# EasyEDA Pro project HNDX.eprj, schematic stm32核心板_1
Board Name: stm32g474_1; Create Date: 2025-06-23; Page Name: P1; Project Name: GP; Schematic Name: stm32核心板_1; Update Date: 2025-06-23; Company: 嘉立创EDA; Page Size: A4; Version: V1.0
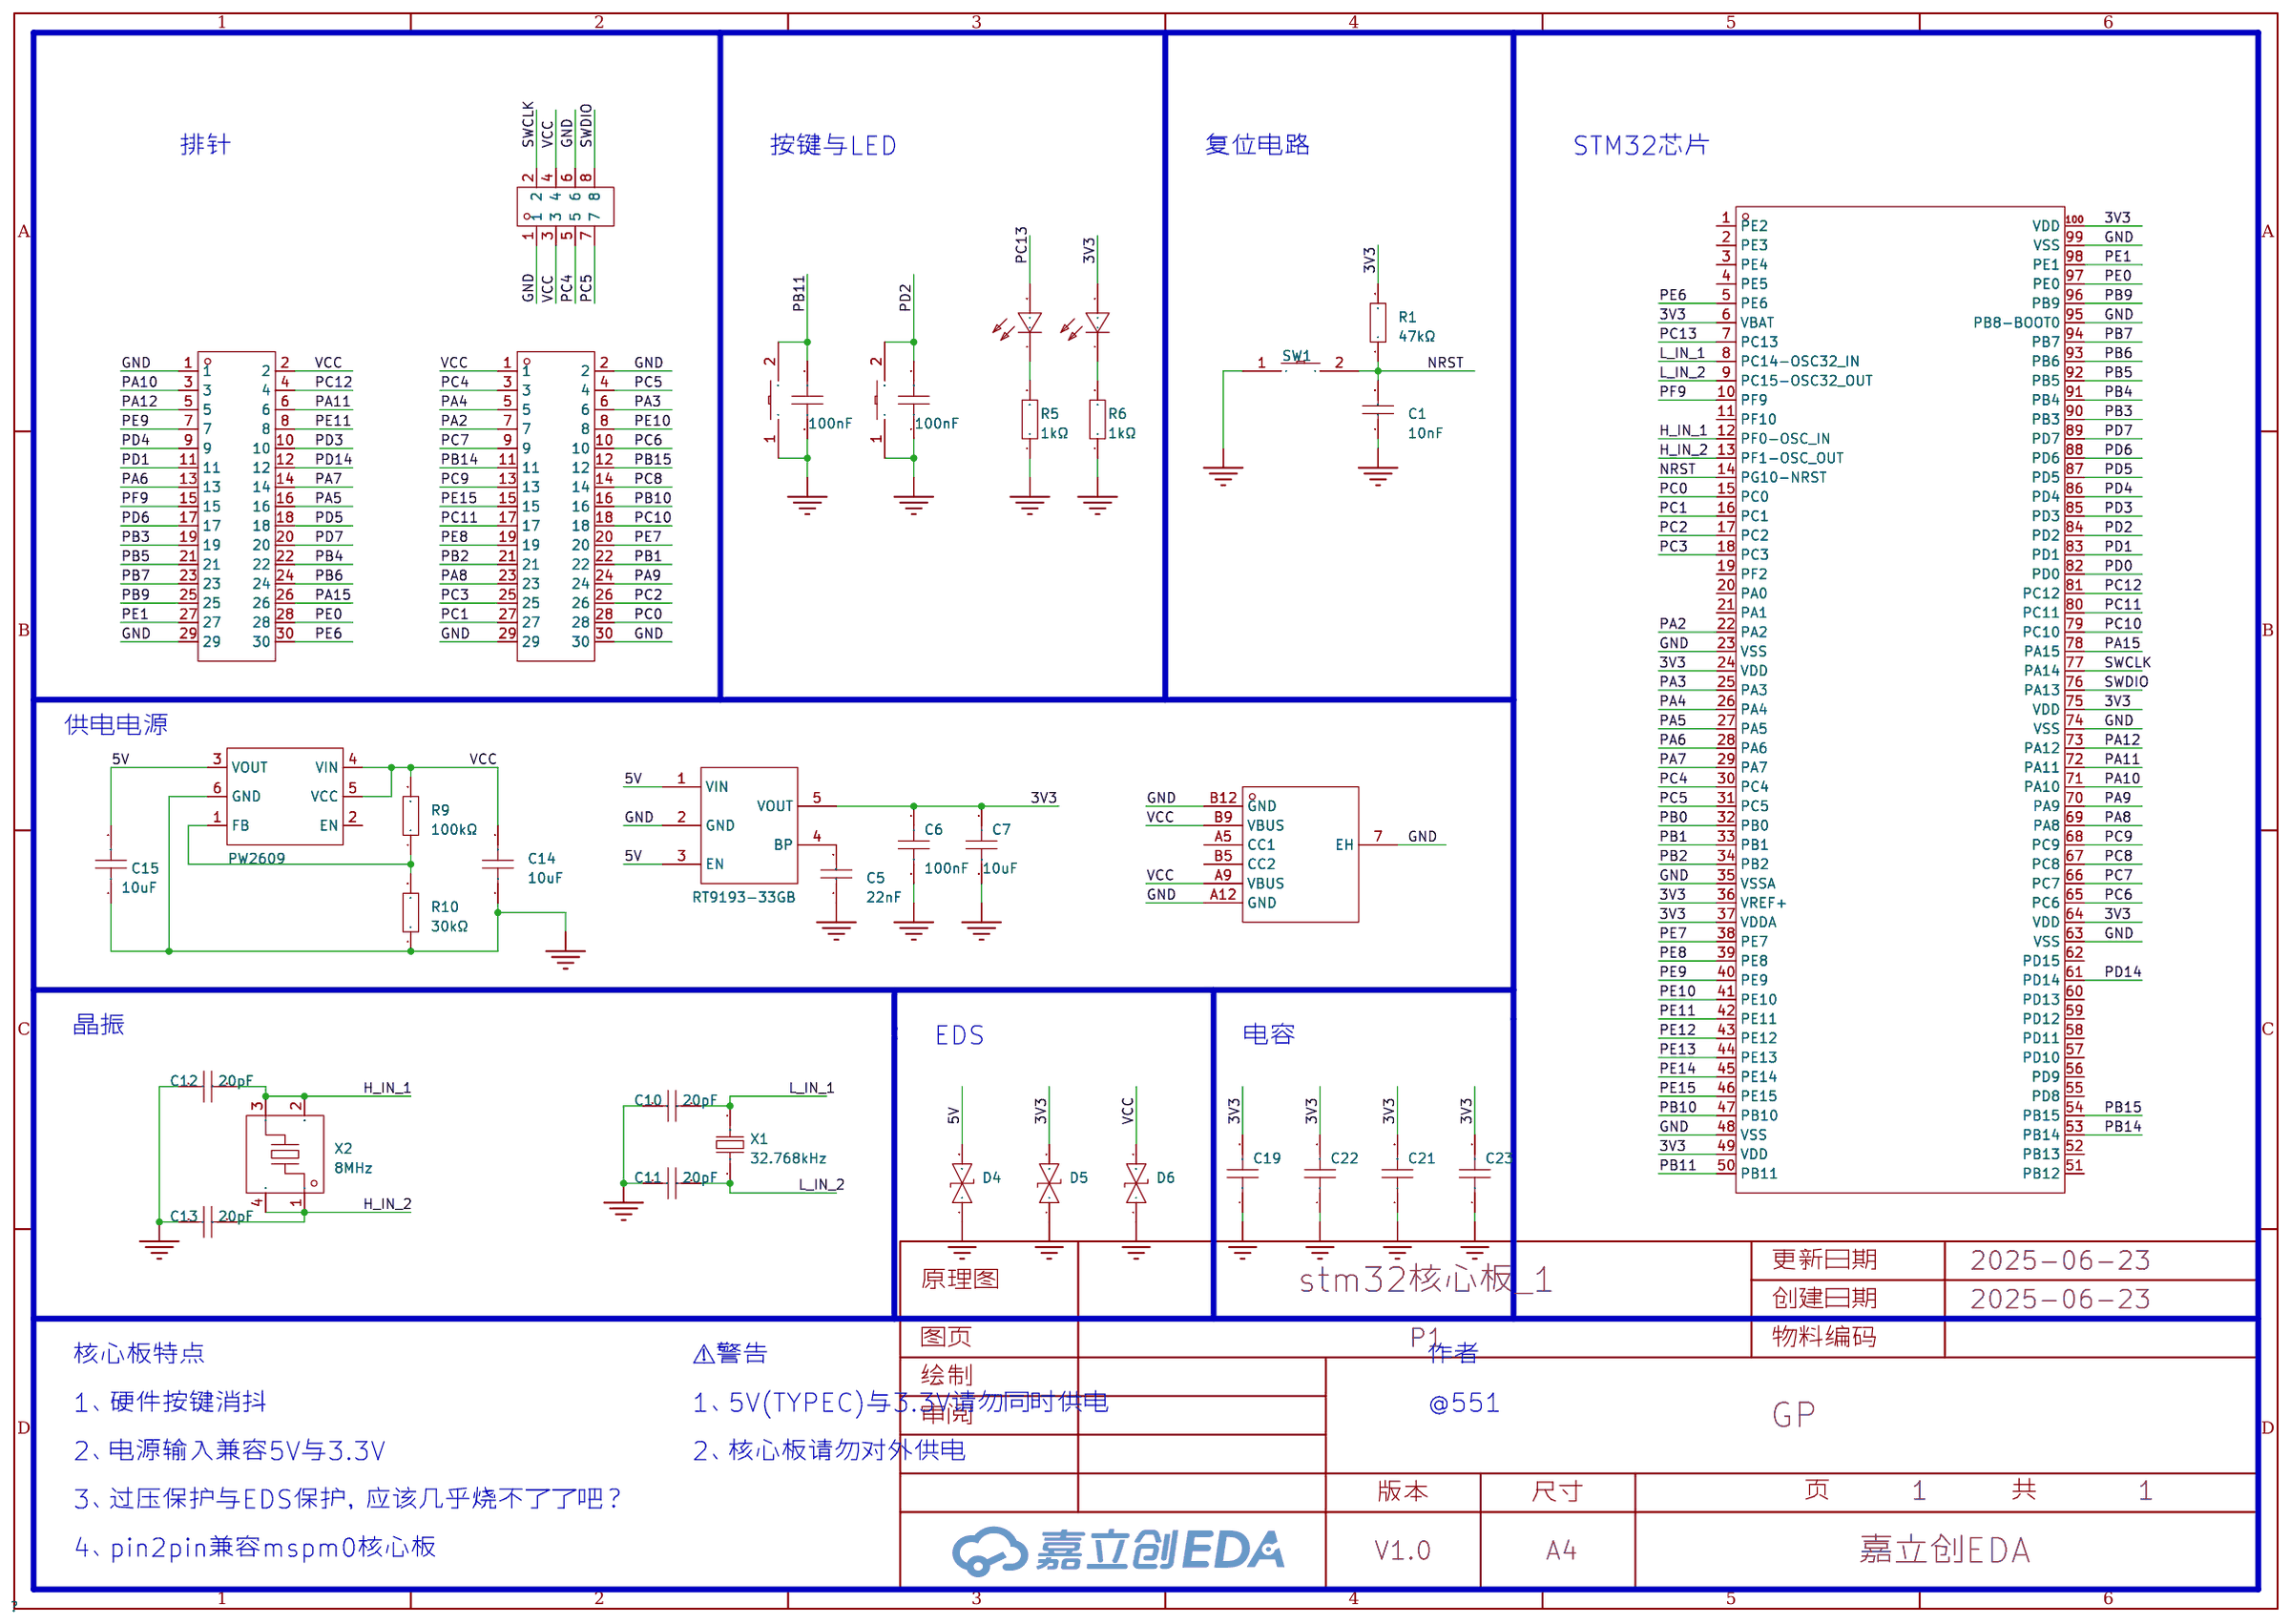
[diagram p6: schematic sheet]

## Parts
C1  10nF  [C0603]
C5  22nF  [C0603]
C6  100nF  [C0603]
C7  10uF  [C0603]
C8  100nF  [C0603]
C9  100nF  [C0603]
C10  20pF  [C0603]
C11  20pF  [C0603]
C12  20pF  [C0603]
C13  20pF  [C0603]
C14  10uF  [C0603]
C15  10uF  [C0603]
C19  100nF  [C0603]
C21  100nF  [C0603]
C22  100nF  [C0603]
C23  100nF  [C0603]
D4  0603ESDA-05N  [D0603-BI]
D5  0603ESDA-05N  [D0603-BI]
D6  0603ESDA-05N  [D0603-BI]
H3  PZ254R-12-8P  [HDR-TH_8P-P2.54-H-M-R2-C4-S2.54]
LED1  NCD0603R1  [LED0603-RD_RED]
LED2  NCD0603R1  [LED0603-RD_RED]
R1  47kΩ  [R0603]
R5  1kΩ  [R0603]
R6  1kΩ  [R0603]
R9  100kΩ  [R0603]
R10  30kΩ  [R0603]
SW1  TS-1101-C-W  [SW-SMD_L6.0-W3.3-LS8.0]
SW2  TS-1101-C-W  [SW-SMD_L6.0-W3.3-LS8.0]
SW3  TS-1101-C-W  [SW-SMD_L6.0-W3.3-LS8.0]
TYPEC  TYPE-C 6P QT073  [USB-C-SMD_TYPE-C-6P-QT073]
U2  RT9193-33GB  [SOT-23-5_L3.0-W1.7-P0.95-LS2.8-BL]
U11  PW2609  [SOT-23-6_L2.9-W1.6-P0.95-LS2.8-BL]
U12  PZ254-2-15-Z-8.5  [HDR-TH_30P-P2.54-V-M-R2-C15-S2.54]
U13  PZ254-2-15-Z-8.5  [HDR-TH_30P-P2.54-V-M-R2-C15-S2.54]
U17  STM32G474VCT6  [LQFP-100_L14.0-W14.0-P0.50-LS16.0-BL]
X1  32.768kHz  [FC-135R_L3.2-W1.5]
X2  8MHz  [CRYSTAL-SMD_4P-L3.2-W2.5-BL-1]

## Library data of the parts
C1 = CC0603KRX7R9BB103: 容值:10nF;精度:±10%;额定电压:50V;材质(温度系数):X7R;; LCSC Part Name: 10nF ±10% 50V; Supplier Part: C100042; Manufacturer: YAGEO(国巨); Supplier Footprint: 0603; JLCPCB Part Class: 扩展库; Datasheet: https://atta.szlcsc.com/upload/public/pdf/source/20181008/C309510_22F155564471FAF6A489F7D68F34234E.pdf; Supplier: LCSC; Tolerance: ±10%; Voltage Rated: 50V; Temperature Coefficient: X7R
C5 = CL10B223KB8NNNC: 容值:22nF;精度:±10%;额定电压:50V;材质(温度系数):X7R;; LCSC Part Name: 22nF ±10% 50V; Supplier Part: C21122; Manufacturer: SAMSUNG(三星); Supplier Footprint: 0603; JLCPCB Part Class: 基础库; Datasheet: https://atta.szlcsc.com/upload/public/pdf/source/20160218/1457707763339.pdf; Supplier: LCSC; Tolerance: ±10%; Voltage Rated: 50V; Temperature Coefficient: X7R
C6 C8 C9 C19 C21-C23 = CC0603KRX7R9BB104: 容值:100nF;精度:±10%;额定电压:50V;材质(温度系数):X7R;; LCSC Part Name: 100nF ±10% 50V; Supplier Part: C14663; Manufacturer: YAGEO(国巨); Supplier Footprint: 0603; JLCPCB Part Class: 基础库; Datasheet: https://atta.szlcsc.com/upload/public/pdf/source/20180910/C282072_33301C7F631E79921B82A8DAC6BCC5B3.pdf; Supplier: LCSC; Tolerance: ±10%; Voltage Rated: 50V; Temperature Coefficient: X7R
C7 = GRM188R61E106KA73D: 容值:10uF;精度:±10%;额定电压:25V;材质(温度系数):X5R;; LCSC Part Name: 10uF ±10% 25V; Supplier Part: C344022; Manufacturer: muRata(村田); Supplier Footprint: 0603; JLCPCB Part Class: 扩展库; Datasheet: https://atta.szlcsc.com/upload/public/pdf/source/20181211/C344022_BB98D43E7DA95E5A749FBFE073C8A3E0.pdf; Supplier: LCSC; Tolerance: ±10%; Voltage Rated: 25V; Temperature Coefficient: X5R
C10-C13 = CC0603JRNPO9BN200: 容值:20pF;精度:±5%;额定电压:50V;材质(温度系数):NP0;; LCSC Part Name: 20pF ±5% 50V; Supplier Part: C105621; Manufacturer: YAGEO(国巨); Supplier Footprint: 0603; JLCPCB Part Class: 扩展库; Datasheet: https://atta.szlcsc.com/upload/public/pdf/source/20170505/1493957838062.pdf; Supplier: LCSC; Tolerance: ±5%; Voltage Rated: 50V; Temperature Coefficient: NP0
C14 C15 = CL10A106KP8NNNC: 容值:10uF;精度:±10%;额定电压:10V;材质(温度系数):X5R;; LCSC Part Name: 10uF ±10% 10V; Supplier Part: C19702; Manufacturer: SAMSUNG(三星); Supplier Footprint: 0603; JLCPCB Part Class: 基础库; Datasheet: https://atta.szlcsc.com/upload/public/pdf/source/20160218/1457707763339.pdf; Supplier: LCSC; Tolerance: ±10%; Voltage Rated: 10V; Temperature Coefficient: X5R
D4-D6 = 0603ESDA-05N: LCSC Part Name: 双向ESD; Supplier Part: C316054; Manufacturer: BORN(伯恩半导体); Supplier Footprint: 0603; JLCPCB Part Class: 扩展库; Datasheet: https://atta.szlcsc.com/upload/public/pdf/source/20200528/C316054_1CC523E9CE69E41C8DD5A05C832CCD1A.pdf; Supplier: LCSC; polarity: 双向; Reverse Stand-Off Voltage (Vrwm): 5V; Maximum Clamping Voltage: 50V; Type: ESD
H3 = PZ254R-12-8P: 插针结构:2x4P;间距:2.54mm;行距:2.54mm;圆针/方针:方针;安装类型:弯插;排数:双排;总PIN位数:8P;额定电流:-;额定电压:-;配合针长度:6mm;塑高:2.5mm;触头材质:黄铜;触头镀层:-;工作温度范围:-40℃~+105℃;颜色:黑色;; LCSC Part Name: 间距:2.54mm 2x4P 弯插 方针; Supplier Part: C492432; Manufacturer: XFCN(兴飞); Supplier Footprint: 弯插,P=2.54mm; JLCPCB Part Class: 扩展库; Datasheet: https://atta.szlcsc.com/upload/public/pdf/source/20200309/C492432_F55471C7391A7FE3415CB31C718B6320.pdf; Supplier: LCSC; Pin Structure: 2x4P; Pitch: 2.54mm; Row Spacing: 2.54mm; Circluar Pins/Square Pins: 方针; Mounting Type: 弯插; Number of Rows: 双排; Number of Pins: 8P; Length of Mating Pin: 6mm; Insulation Height: 2.5mm; Contact Material: 黄铜; Operating Temperature Range: -40℃~+105℃; Color: 黑色
LED1 LED2 = NCD0603R1_C84263: 灯头类型:-;发光颜色:红色;正向电压(VF):1.6V~2.6V;功率:65mW;正向电流:20mA;主波长:615nm~630nm;二极管配置:独立二极管;透镜颜色:无色透明透镜;色温:-;发光强度:80mcd~220mcd;发光角度:130°;载带方式:-;工作温度:-30℃~+85℃;; Supplier Part: C84263; Manufacturer: 国星光电; Supplier Footprint: 0603; JLCPCB Part Class: 扩展库; Datasheet: https://atta.szlcsc.com/upload/public/pdf/source/20200820/C84263_DABC6A75E58F576973B407FDBA283D60.pdf; Supplier: LCSC; Emitted Color: 红色; Forward Voltage (VF): 1.6V~2.6V; Power Dissipation: 65mW; Forward Current: 20mA; Dominant Wavelength: 615nm~630nm; Diode Configuration: 独立二极管; Lens Color: 无色透明透镜; Luminous Intensity: 80mcd~220mcd; Viewing Angle: 130°; Operating Temperature: -30℃~+85℃
R1 = 0603WAF4702T5E: 电阻类型:厚膜电阻;阻值:47kΩ;精度:±1%;功率:100mW;最大工作电压:75V;温度系数:±100ppm/℃;; LCSC Part Name: 47kΩ ±1% 100mW 厚膜电阻; Supplier Part: C25819; Manufacturer: UNI-ROYAL(厚声); Supplier Footprint: 0603; JLCPCB Part Class: 基础库; Datasheet: https://atta.szlcsc.com/upload/public/pdf/source/20200306/C422600_1E6D84923E4A46A82E41ADD87F860B5C.pdf; Supplier: LCSC; Type: 厚膜电阻; Tolerance: ±1%; Power(Watts): 100mW; Overload Voltage (Max): 75V; Temperature Coefficient: ±100ppm/℃; Operating Temperature Range: -55℃~+155℃
R5 R6 = 0603WAF1001T5E: 电阻类型:厚膜电阻;阻值:1kΩ;精度:±1%;功率:100mW;最大工作电压:75V;温度系数:±100ppm/℃;; LCSC Part Name: 1kΩ ±1% 100mW 厚膜电阻; Supplier Part: C21190; Manufacturer: UNI-ROYAL(厚声); Supplier Footprint: 0603; JLCPCB Part Class: 基础库; Datasheet: https://atta.szlcsc.com/upload/public/pdf/source/20200306/C422600_1E6D84923E4A46A82E41ADD87F860B5C.pdf; Supplier: LCSC; Type: 厚膜电阻; Tolerance: ±1%; Power(Watts): 100mW; Overload Voltage (Max): 75V; Temperature Coefficient: ±100ppm/℃; Operating Temperature Range: -55℃~+155℃
R9 = RC0603FR-07100KL: 电阻类型:厚膜电阻;阻值:100kΩ;精度:±1%;功率:100mW;最大工作电压:75V;温度系数:±100ppm/℃;; LCSC Part Name: 厚膜电阻 100kΩ ±1% 100mW; Supplier Part: C14675; Manufacturer: YAGEO(国巨); Supplier Footprint: 0603; JLCPCB Part Class: 扩展库; Datasheet: https://atta.szlcsc.com/upload/public/pdf/source/20140324/1457707028752.pdf; Supplier: LCSC; Type: 厚膜电阻; Tolerance: ±1%; Power(Watts): 100mW; Overload Voltage (Max): 75V; Temperature Coefficient: ±100ppm/℃; Operating Temperature Range: -55℃~+155℃
R10 = 0603WAF3002T5E: 电阻类型:厚膜电阻;阻值:30kΩ;精度:±1%;功率:100mW;最大工作电压:75V;温度系数:±100ppm/℃;; LCSC Part Name: 30kΩ ±1% 100mW 厚膜电阻; Supplier Part: C22984; Manufacturer: UNI-ROYAL(厚声); Supplier Footprint: 0603; JLCPCB Part Class: 基础库; Datasheet: https://atta.szlcsc.com/upload/public/pdf/source/20200306/C422600_1E6D84923E4A46A82E41ADD87F860B5C.pdf; Supplier: LCSC; Type: 厚膜电阻; Tolerance: ±1%; Power(Watts): 100mW; Overload Voltage (Max): 75V; Temperature Coefficient: ±100ppm/℃; Operating Temperature Range: -55℃~+155℃
SW1-SW3 = TS-1101-C-W: 电路结构:单刀单掷;按钮形状:矩形按钮;作用力:260gf;安装方式:立贴;开关长度:6mm;开关宽度:3.6mm;开关高度:2.5mm;带支架:不带;触点电流:50mA;额定电压(AC):-;额定电压(DC):12V;额定功率:-;绝缘电阻:-;带灯:无;机械寿命:5万次;; LCSC Part Name: 6*3.6*2.5mm 立贴 轻触开关; Supplier Part: C318938; Manufacturer: XKB Connectivity(中国星坤); Supplier Footprint: SMD; JLCPCB Part Class: 扩展库; Datasheet: https://atta.szlcsc.com/upload/public/pdf/source/20200227/C318938_C2E53B1EEDE37D980A33616AC086DE53.pdf; Supplier: LCSC; Circuit: 单刀单掷; Actuator Style: 矩形按钮; Operating Force: 260gf; Mounting Style: 立贴; Switch Length: 6mm; Switch Width: 3.6mm; Switch Height: 2.5mm; Strike Gundam: 不带; Contact Current: 50mA; Voltage Rating (DC): 12V; Actuator/Cap Color: 白色带淡绿; With Lamp: 无; Mechanical Life: 5万次; Operating Temperature: -30℃~+85℃
TYPEC = TYPE-C 6P QT073: LCSC Part Name: Type-C 母 卧贴; Supplier Part: C2681548; Manufacturer: SHOU HAN(首韩); Supplier Footprint: SMD; JLCPCB Part Class: 扩展库; Datasheet: https://atta.szlcsc.com/upload/public/pdf/source/20220215/CBBB29EB4E3B4CE4A38B8E19076C4334.pdf; Supplier: LCSC; Connector Type: Type-C; Standard: USB 3.1; Gender: 母; Mounting Style: 卧贴; Number of Contacts: 6P; Number of Ports: 1; Current Rating - Power (Max): 3A; Operating Temperature Range: -25℃~+85℃; Rated Voltage (Max): 5V; Connect-Disconnect Life: 1万次; Core Colour: 黑色
U2 = RT9193-33GB: 输出类型:固定;最大输入电压:5.5V;输出电压:3.3V;最大输出电流:300mA;电源纹波抑制比(PSRR):70dB;输出极性:正极;; LCSC Part Name: 输入5.5V 输出3.3V 300mA; Supplier Part: C15651; Manufacturer: RICHTEK(立锜); Supplier Footprint: SOT-23-5; JLCPCB Part Class: 扩展库; Datasheet: https://atta.szlcsc.com/upload/public/pdf/source/20130730/1457706628575.pdf; Supplier: LCSC; Output Type: 固定; Maximum Input Voltage: 5.5V; Output Voltage: 3.3V; MAX Output Current: 300mA; Power Supply Rejection Ratio (PSRR): 70dB; Dropout Voltage: 300mV@(300mA); standby current: 130uA; Operating Temperature: -40℃~+125℃; Output Polarity: 正极; Number of Outputs: 1
U11 = PW2609: Supplier Part: C9900022406; Supplier Footprint: SOT-23-6; JLCPCB Part Class: 扩展库; Supplier: LCSC
U12 U13 = PZ254-2-15-Z-8.5: 插针结构:2x15P;间距:2.54mm;圆针/方针:方针;安装类型:直插;排数:双排;总PIN位数:30P;额定电流:3A;额定电压:-;配合针长度:6mm;塑高:2.5mm;端接针长度:3mm;触头材质:黄铜;工作温度范围:-40℃~+105℃;焊接温度(最大值):260℃@10S;颜色:黑色;; LCSC Part Name: 2x15P 间距:2.54mm 方针 直插; Supplier Part: C3012255; Manufacturer: HCTL(华灿天禄); Supplier Footprint: 插件,P=2.54mm; JLCPCB Part Class: 扩展库; Datasheet: https://atta.szlcsc.com/upload/public/pdf/source/20230609/5BA09C8BEB9B31376F8BF6032FF67CAC.pdf; Supplier: LCSC; Pin Structure: 2x15P; Pitch: 2.54mm; Circluar Pins/Square Pins: 方针; Mounting Type: 直插; Number of Rows: 双排; Number of Pins: 30P; Current Rating (Max): 3A; Length of Mating Pin: 6mm; Insulation Height: 2.5mm; Length of End Connection Pin: 3mm; Contact Material: 黄铜; Operating Temperature Range: -40℃~+105℃; Soldering Temperature(Max): 260℃@10S; Color: 黑色
U17 = STM32G474VCT6: CPU内核:-;程序存储容量:256KB;RAM总容量:128KB;GPIO端口数量:86;工作电压范围:1.71V~3.6V;CPU最大主频:170MHz;程序存储器类型:FLASH;; LCSC Part Name: 带DSP和FPU的170MHz主流ARM Cortex-M4 MCU，具有256 KB Flash存储器、数学加速器、高分辨率定时器和高模拟电平集成; Supplier Part: C730131; Manufacturer: ST(意法半导体); Supplier Footprint: LQFP-100(14x14); JLCPCB Part Class: 扩展库; Datasheet: https://atta.szlcsc.com/upload/public/pdf/source/20200902/C431632_38212262685EE30B1989689374F08940.pdf; Supplier: LCSC; Program Storage Size: 256KB; RAM Size: 128KB; GPIO Ports Number: 86; Operating Voltage Range: 1.71V~3.6V; CPU Maximum Speed: 170MHz; Program Memory Type: FLASH; Operating Temperature Range: -40℃~+85℃; ADC (Bit): 12bit; DAC (Bit): 12bit; Peripheral/Function: PWM；PWM; Watchdog: 有; Infrared Data Association: 有; Low-Voltage Detect: 有; Direct Memory Access: 有; Internal Oscillator: 有
X1 = Q13FC13500004_C32346: 晶振类型:贴片晶振;频率:32.768kHz;常温频差:±20ppm;外接负载电容:12.5pF;; LCSC Part Name: 32.768kHz ±20ppm 12.5pF; Supplier Part: C32346; Manufacturer: EPSON(爱普生); Manufacturer Part: Q13FC13500004; Supplier Footprint: SMD3215-2P; JLCPCB Part Class: 基础库; Datasheet: https://atta.szlcsc.com/upload/public/pdf/source/20240418/0E0FF5F0356BA3753F616001439D1416.pdf; Supplier: LCSC; Crystal Type: 贴片晶振; Normal temperature Frequency Tolerance: ±20ppm; External load capacitor: 12.5pF; Equivalent Series Resistance (ESR): 70kΩ; Operating Temperature: -40℃~+85℃
X2 = XL2EL89COI-111YLC-8M: 晶振类型:贴片晶振;频率:8MHz;常温频差:±10ppm;外接负载电容:12pF;频率稳定度(全温):±20ppm;; LCSC Part Name: 8MHz ±10ppm 12pF; Supplier Part: C2973805; Manufacturer: YXC(扬兴晶振); Supplier Footprint: SMD3225-4P; JLCPCB Part Class: 扩展库; Datasheet: https://atta.szlcsc.com/upload/public/pdf/source/20240329/19D5F850207469550BEB00D7DFEDBC7A.pdf; Supplier: LCSC; Crystal Type: 贴片晶振; Normal temperature Frequency Tolerance: ±10ppm; External load capacitor: 12pF; Frequency Stability(Full temperature range): ±20ppm; Equivalent Series Resistance (ESR): 150Ω; Operating Temperature: -40℃~+85℃

## Nets
3V3: C6.1 C7.1 C19.2 C21.2 C22.2 C23.2 D5.2 LED2.2(A) R1.2 U2.5(VOUT) U17.6(VBAT) U17.24(VDD) U17.36(VREF+) U17.37(VDDA) U17.49(VDD) U17.64(VDD) U17.75(VDD) U17.100(VDD)
5V: C15.2 D4.2 U2.1(VIN) U2.3(EN) U11.3(VOUT)
GND: C1.1 C5.1 C6.2 C7.2 C8.2 C9.1 C10.1 C11.1 C12.1 C13.1 C14.1 C15.1 C19.1 C21.1 C22.1 C23.1 D4.1 D5.1 D6.1 H3.1 H3.6 R5.1 R6.1 R10.1 SW1.1 SW2.1 SW3.1 TYPEC.7(EH) TYPEC.A12(GND) TYPEC.B12(GND) U2.2(GND) U11.6(GND) U12.2 U12.29 U12.30 U13.1 U13.29 U17.23(VSS) U17.35(VSSA) U17.48(VSS) U17.63(VSS) U17.74(VSS) U17.95(PB8-BOOT0) U17.99(VSS)
VCC: C14.2 D6.2 H3.3 H3.4 R9.2 TYPEC.A9(VBUS) TYPEC.B9(VBUS) U11.4(VIN) U11.5(VCC) U12.1 U13.2
H_IN_1: C12.2 U17.12(PF0-OSC_IN) X2.2(GND) X2.3
H_IN_2: C13.2 U17.13(PF1-OSC_OUT) X2.1 X2.4(GND)
L_IN_1: C10.2 U17.8(PC14-OSC32_IN) X1.2
L_IN_2: C11.2 U17.9(PC15-OSC32_OUT) X1.1
NRST: C1.2 R1.1 SW1.2 U17.14(PG10-NRST)
PA2: U12.7 U17.22(PA2)
PA3: U12.6 U17.25(PA3)
PA4: U12.5 U17.26(PA4)
PA5: U13.16 U17.27(PA5)
PA6: U13.13 U17.28(PA6)
PA7: U13.14 U17.29(PA7)
PA8: U12.23 U17.69(PA8)
PA9: U12.24 U17.70(PA9)
PA10: U13.3 U17.71(PA10)
PA11: U13.6 U17.72(PA11)
PA12: U13.5 U17.73(PA12)
PA15: U13.26 U17.78(PA15)
PB0: U17.32(PB0)
PB1: U12.22 U17.33(PB1)
PB2: U12.21 U17.34(PB2)
PB3: U13.19 U17.90(PB3)
PB4: U13.22 U17.91(PB4)
PB5: U13.21 U17.92(PB5)
PB6: U13.24 U17.93(PB6)
PB7: U13.23 U17.94(PB7)
PB9: U13.25 U17.96(PB9)
PB10: U12.16 U17.47(PB10)
PB11: C8.1 SW2.2 U17.50(PB11)
PB14: U12.11 U17.53(PB14)
PB15: U12.12 U17.54(PB15)
PC0: U12.28 U17.15(PC0)
PC1: U12.27 U17.16(PC1)
PC2: U12.26 U17.17(PC2)
PC3: U12.25 U17.18(PC3)
PC4: H3.5 U12.3 U17.30(PC4)
PC5: H3.7 U12.4 U17.31(PC5)
PC6: U12.10 U17.65(PC6)
PC7: U12.9 U17.66(PC7)
PC8: U12.14 U17.67(PC8)
PC9: U12.13 U17.68(PC9)
PC10: U12.18 U17.79(PC10)
PC11: U12.17 U17.80(PC11)
PC12: U13.4 U17.81(PC12)
PC13: LED1.2(A) U17.7(PC13)
PD0: U17.82(PD0)
PD1: U13.11 U17.83(PD1)
PD2: C9.2 SW3.2 U17.84(PD2)
PD3: U13.10 U17.85(PD3)
PD4: U13.9 U17.86(PD4)
PD5: U13.18 U17.87(PD5)
PD6: U13.17 U17.88(PD6)
PD7: U13.20 U17.89(PD7)
PD14: U13.12 U17.61(PD14)
PE0: U13.28 U17.97(PE0)
PE1: U13.27 U17.98(PE1)
PE6: U13.30 U17.5(PE6)
PE7: U12.20 U17.38(PE7)
PE8: U12.19 U17.39(PE8)
PE9: U13.7 U17.40(PE9)
PE10: U12.8 U17.41(PE10)
PE11: U13.8 U17.42(PE11)
PE12: U17.43(PE12)
PE13: U17.44(PE13)
PE14: U17.45(PE14)
PE15: U12.15 U17.46(PE15)
PF9: U13.15 U17.10(PF9)
SWCLK: H3.2 U17.77(PA14)
SWDIO: H3.8 U17.76(PA13)
$1N1418: C5.2 U2.4(BP)
$1N2545: LED2.1(K) R6.2
$1N13658: R9.1 R10.2 U11.1(FB)
$1N18671: LED1.1(K) R5.2

Not connected (* = marked no-connect by the designer): TYPEC A5(CC1) B5(CC2); U11 2(EN); U17 1(PE2) 2(PE3) 3(PE4) 4(PE5) 11(PF10) 19(PF2) 20(PA0) 21(PA1) 51(PB12) 52(PB13) 55(PD8) 56(PD9) 57(PD10) 58(PD11) 59(PD12) 60(PD13) 62(PD15)

## Notes on the sheet
- 排针
- 按键与LED
- 复位电路
- STM32芯片
- 供电电源
- 晶振
- EDS
- 电容
- 核心板特点
- ⚠警告
- 作者
- 1、硬件按键消抖
- 1、5V(TYPEC)与3.3V请勿同时供电
- @551
- 2、电源输入兼容5V与3.3V
- 2、核心板请勿对外供电
- 3、过压保护与EDS保护，应该几乎烧不了了吧？
- 4、pin2pin兼容mspm0核心板
